# Altium project V_12.PrjPcb
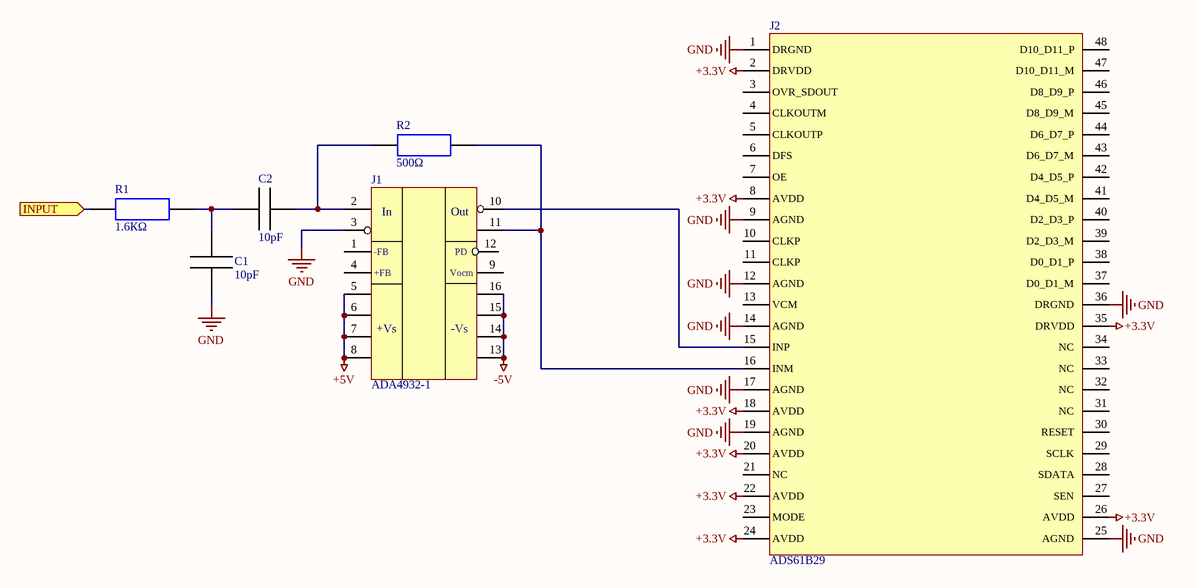
[diagram p0: V_12.SchDoc]
1 sheet, 6 parts. Net scope: flat (ports and power ports of the same name join across sheets).
Board file: V_12.PcbDoc

## Sheet V_12.SchDoc
size A4

### Parts
C1  10pF  [1206]
C2  10pF  [1206]
J1  ADA4932-1  [LFCSP_WQ]
J2  ADS61B29  [VQFN]
R1  1.6КΩ  [1206]
R2  500Ω  [1206]

### Ports
INPUT (in)

### Nets
+3.3V: J2.2(DRVDD) J2.8(AVDD) J2.18(AVDD) J2.20(AVDD) J2.22(AVDD) J2.24(AVDD) J2.26(AVDD) J2.35(DRVDD)
+5V: J1.5(+Vs) J1.6(+Vs) J1.7(+Vs) J1.8(+Vs)
-5V: J1.13(-Vs) J1.14(-Vs) J1.15(-Vs) J1.16(-Vs)
GND: C1.1 J1.3(-IN) J2.1(DRGND) J2.9(AGND) J2.12(AGND) J2.14(AGND) J2.17(AGND) J2.19(AGND) J2.25(AGND) J2.36(DRGND)
NetC1_2: C1.2 C2.1 R1.2
NetC2_2: C2.2 J1.2(+IN) R2.1
NetJ1_10: J1.10(+OUT) J2.15(INP)
NetJ1_11: J1.11(-OUT) J2.16(INM) R2.2
NetR1_1: R1.1 ; port INPUT

Not connected (* = marked no-connect by the designer): J1 1(-FB) 4(+FB) 9(Vocm) 12(PD); J2 3(OVR_SDOUT) 4(CLKOUTM) 5(CLKOUTP) 6(DFS) 7(OE) 10(CLKP) 11(CLKP) 13(VCM) 21(NC) 23(MODE) 27(SEN) 28(SDATA) 29(SCLK) 30(RESET) 31(NC) 32(NC) 33(NC) 34(NC) 37(D0_D1_M) 38(D0_D1_P) 39(D2_D3_M) 40(D2_D3_P) 41(D4_D5_M) 42(D4_D5_P) 43(D6_D7_M) 44(D6_D7_P) 45(D8_D9_M) 46(D8_D9_P) 47(D10_D11_M) 48(D10_D11_P)

### Notes on the sheet
- (in symbol ADA4932-1) In; Out

### Library data of the parts
C1 C2 = C
R1 R2 = R